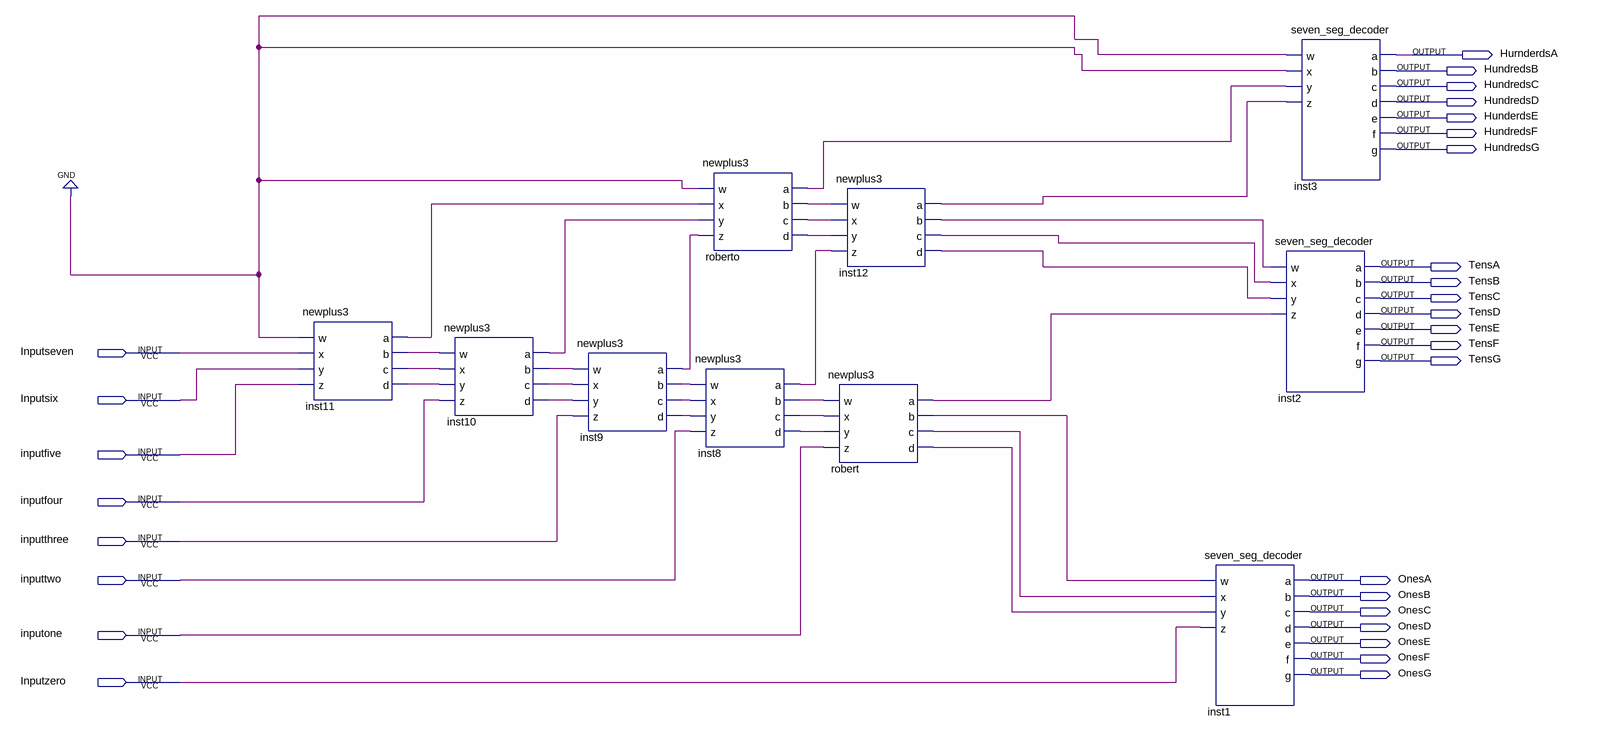
[diagram p0: schematic sheet]
// Quartus schematic converter.bdf as structural Verilog: 10 symbols, 29 pins
module converter (
  input  Inputseven,
  input  Inputsix,
  input  inputfive,
  input  inputfour,
  input  inputthree,
  input  inputtwo,
  input  inputone,
  input  Inputzero,
  output HurnderdsA,
  output HundredsB,
  output HundredsC,
  output HundredsD,
  output HunderdsE,
  output HundredsF,
  output HundredsG,
  output TensA,
  output TensB,
  output TensC,
  output TensD,
  output TensE,
  output TensF,
  output TensG,
  output OnesA,
  output OnesB,
  output OnesC,
  output OnesD,
  output OnesE,
  output OnesF,
  output OnesG
);

  wire inst8_a, inst8_b, inst8_c, inst8_d, inst9_a, inst9_b, inst9_c, inst9_d, inst10_a, inst10_b, inst10_c,
       inst10_d, inst11_a, inst11_b, inst11_c, inst11_d, inst12_a, inst12_b, inst12_c, inst12_d, robert_a,
       robert_b, robert_c, robert_d, roberto_a, roberto_b, roberto_c, roberto_d;

  newplus3 inst11 (
    .w(1'b0), .x(Inputseven), .y(Inputsix), .z(inputfive), .a(inst11_a), .b(inst11_b), .c(inst11_c),
    .d(inst11_d));
  newplus3 inst10 (
    .w(inst11_b), .x(inst11_c), .y(inst11_d), .z(inputfour), .a(inst10_a), .b(inst10_b), .c(inst10_c),
    .d(inst10_d));
  newplus3 inst9 (
    .w(inst10_b), .x(inst10_c), .y(inst10_d), .z(inputthree), .a(inst9_a), .b(inst9_b), .c(inst9_c),
    .d(inst9_d));
  newplus3 roberto (
    .w(1'b0), .x(inst11_a), .y(inst10_a), .z(inst9_a), .a(roberto_a), .b(roberto_b), .c(roberto_c),
    .d(roberto_d));
  newplus3 inst8 (
    .w(inst9_b), .x(inst9_c), .y(inst9_d), .z(inputtwo), .a(inst8_a), .b(inst8_b), .c(inst8_c), .d(inst8_d));
  newplus3 inst12 (
    .w(roberto_b), .x(roberto_c), .y(roberto_d), .z(inst8_a), .a(inst12_a), .b(inst12_b), .c(inst12_c),
    .d(inst12_d));
  newplus3 robert (
    .w(inst8_b), .x(inst8_c), .y(inst8_d), .z(inputone), .a(robert_a), .b(robert_b), .c(robert_c),
    .d(robert_d));
  seven_seg_decoder inst1 (
    .w(robert_b), .x(robert_c), .y(robert_d), .z(Inputzero), .a(OnesA), .b(OnesB), .c(OnesC), .d(OnesD),
    .e(OnesE), .f(OnesF), .g(OnesG));
  seven_seg_decoder inst2 (
    .w(inst12_b), .x(inst12_c), .y(inst12_d), .z(robert_a), .a(TensA), .b(TensB), .c(TensC), .d(TensD),
    .e(TensE), .f(TensF), .g(TensG));
  seven_seg_decoder inst3 (
    .w(1'b0), .x(1'b0), .y(roberto_a), .z(inst12_a), .a(HurnderdsA), .b(HundredsB), .c(HundredsC),
    .d(HundredsD), .e(HunderdsE), .f(HundredsF), .g(HundredsG));
endmodule
